# Altium project PROC114E3_SCH.PrjPcb (part 17 of 22)

## Sheet 34.SchDoc
size 513 x 386 mm
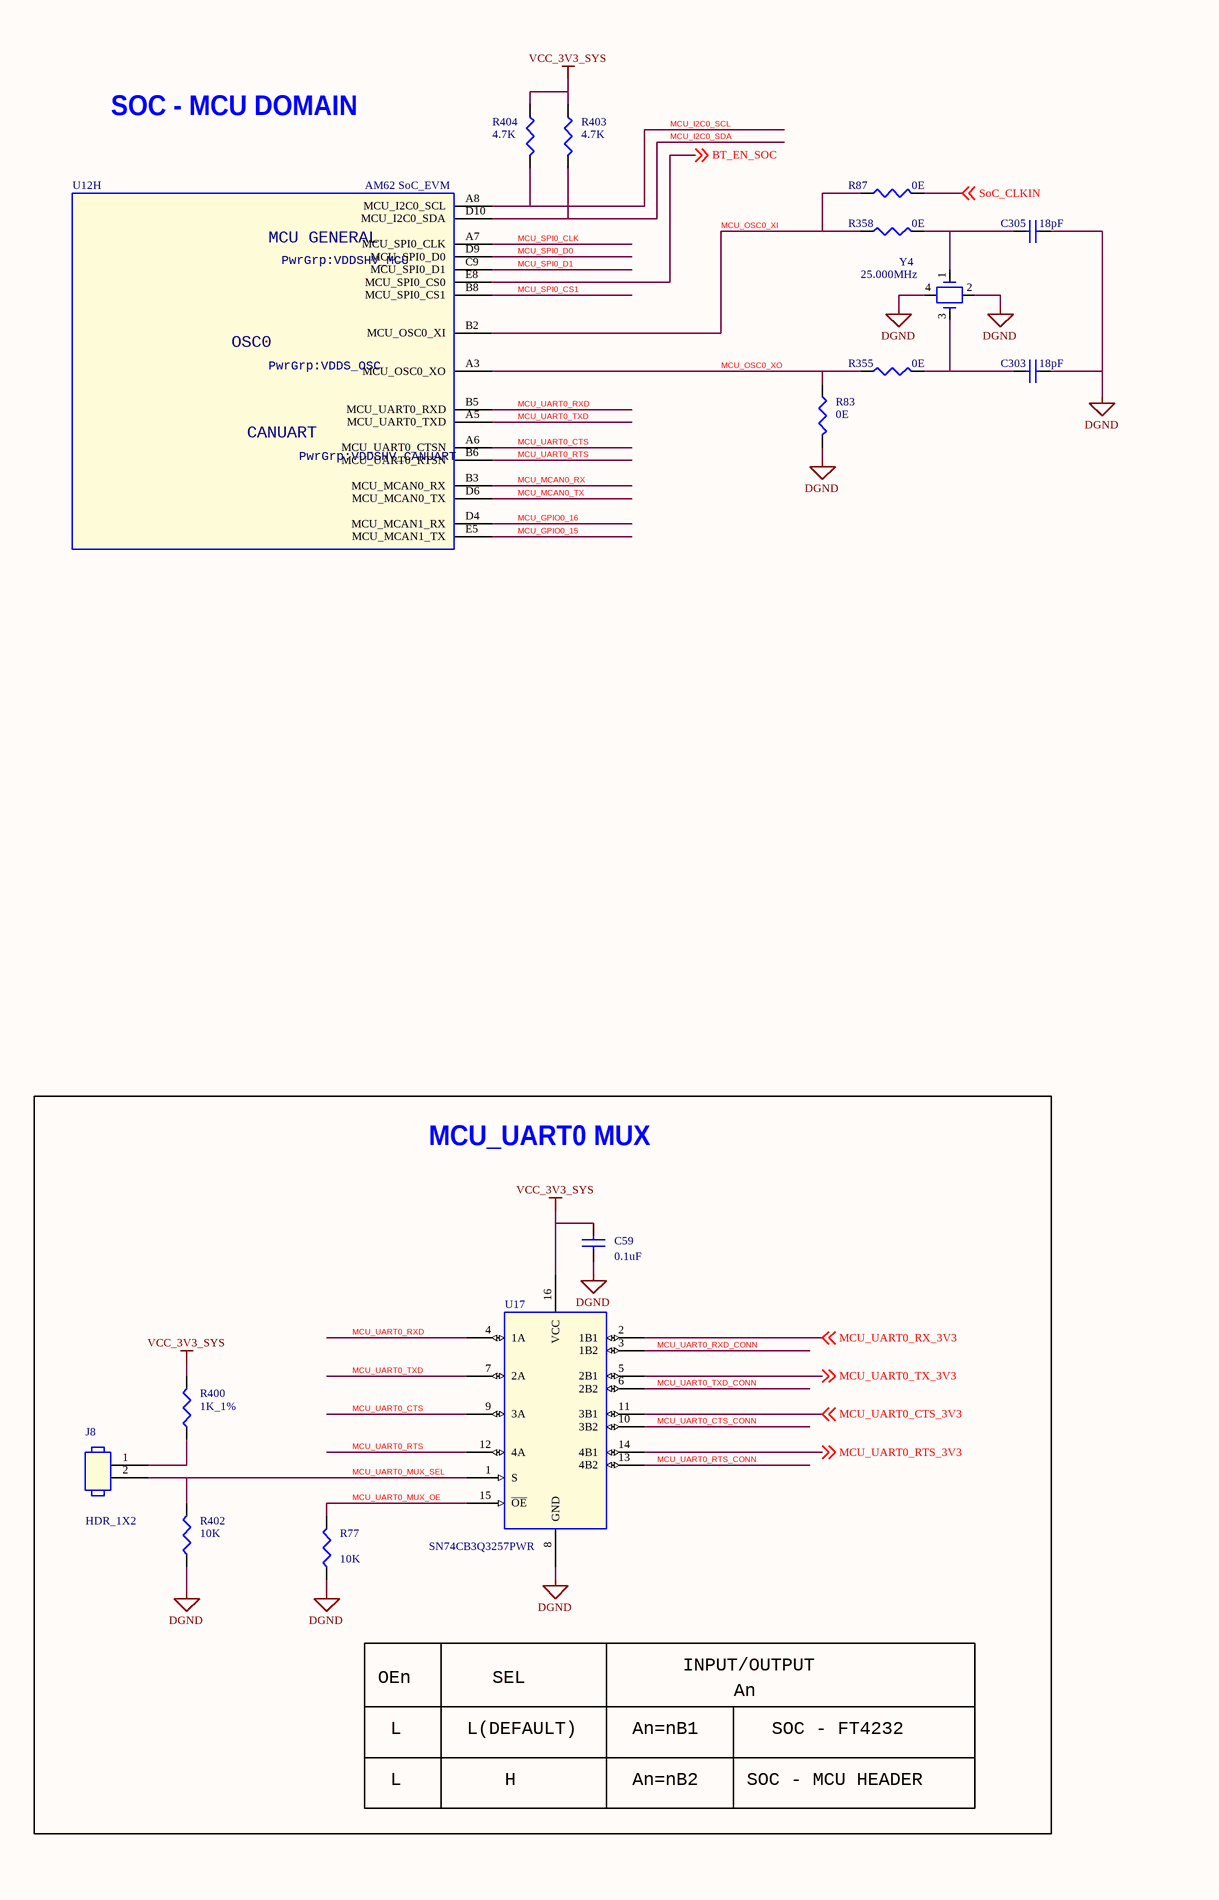
[diagram p60: 34.SchDoc, left]
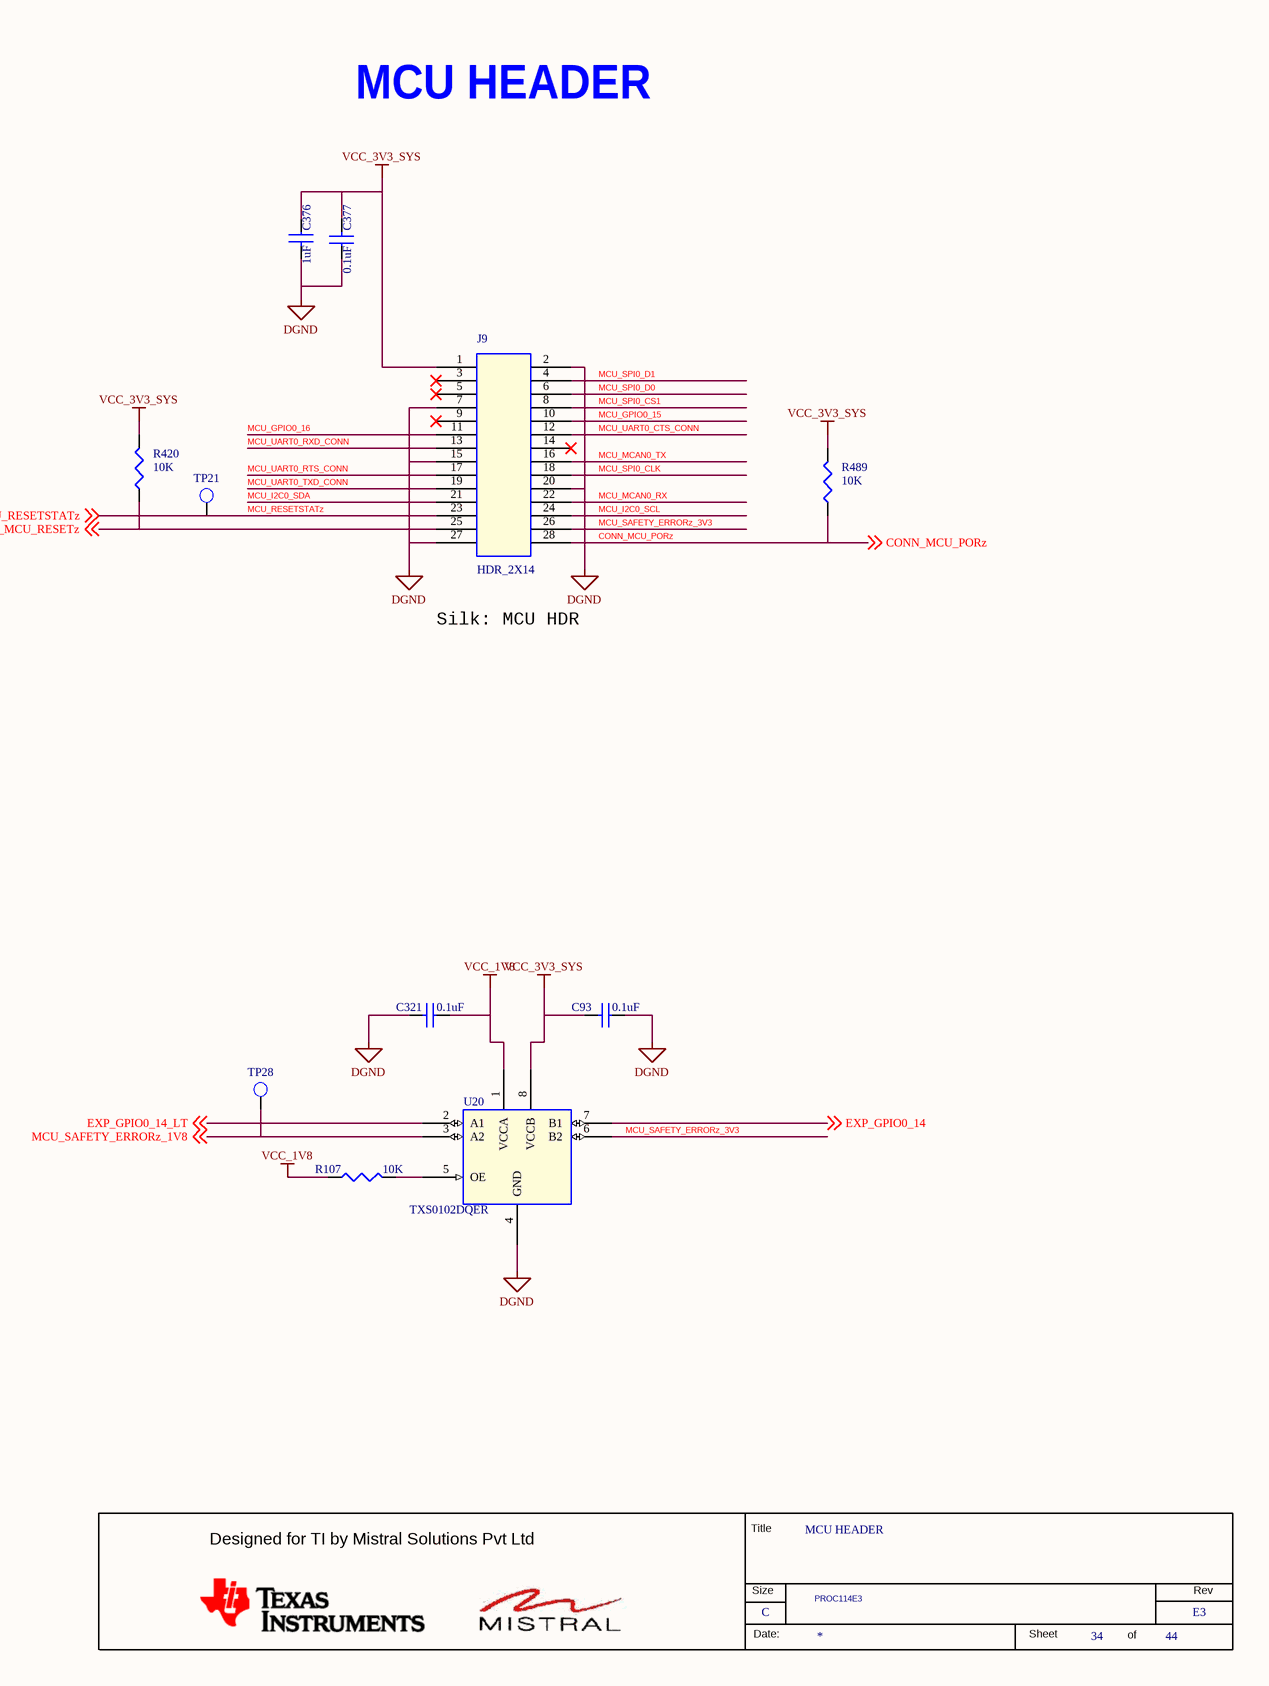
[diagram p61: 34.SchDoc, right]

### Parts
(Parts that share a designator on the sheet are numbered #1, #2 ... from top to bottom, then left to right.)
*#34  RevCode: E3  Title: MCU HEADER  Page Size: C  Page Number: 34  Page Count: 44  Variant Name: PROC114E3  (hidden comment: MISTRAL_TITLEBLK_CSIZE)  (graphical)
C59  0.1uF  [CAP0402_0-75]
C93  0.1uF  [CAP0201_0-5]
C303  18pF  [CAP0402_0-75]
C305  18pF  [CAP0402_0-75]
C321  0.1uF  [CAP0201_0-5]
C376  1uF  [CAP0201_0-5]
C377  0.1uF  [CAP0402_0-75]
J8  HDR_1X2  [HDR_1X2_90120-0122_S_T_5-6]
J9  HDR_2X14  [HDR_14X2_100_S_T]
R77  10K  [RES0201_0-5]
R83  0E  [RES0201_0-5]
R87  0E  [RES0201_0-5]
R107  10K  [RES0201_0-5]
R355  0E  [RES0402_0-5]
R358  0E  [RES0402_0-5]
R400  1K_1%  [RES0402_0-5]
R402  10K  [RES0201_0-5]
R403  4.7K  [RES0201_0-5]
R404  4.7K  [RES0201_0-5]
R420  10K  [RES0201_0-5]
R489  10K  [RES0201_0-5]
TP21  TP20_SMD  [TP20_SMD]  (value not drawn)
TP28  TP20_SMD  [TP20_SMD]  (value not drawn)
U12#2  AM62 SoC_EVM  [BGA425_19-68_510X510_0-7]  (part H of 18)
U17  SN74CB3Q3257PWR  [TSSOP16_25-59_205X180]
U20  TXS0102DQER  [X2SON8_TXS0102_40X60_0-4]
Y4  25.000MHz  [XTAL4_XRCGB-FM_80X60_SMD_0-7]

### Blocks framed on the sheet
MCU_UART0 MUX: C59 J8 R77 R400 R402 U17

### Nets
DGND: C59.1 C93.1 C303.1 C305.1 C321.2 C376.2 C377.1 J9.2 J9.7 J9.15 J9.20 J9.27 R77.2 R83.1 R402.1 U17.8(GND) U20.4(GND) Y4.2 Y4.4
VCC_1V8: C321.1 R107.1 U20.1(VCCA)
VCC_3V3_SYS: C59.2 C93.2 C376.1 C377.2 J9.1 R400.2 R403.1 R404.1 R420.2 R489.2 U17.16(VCC) U20.8(VCCB)
BT_EN_SOC: U12#2.E8(MCU_SPI0_CS0) ; off-sheet BT_EN_SOC
CONN_MCU_PORz: J9.28 R489.1 ; off-sheet CONN_MCU_PORz
CONN_MCU_RESETz: J9.25 R420.1 ; off-sheet CONN_MCU_RESETz
EXP_GPIO0_14: U20.7(B1) ; off-sheet EXP_GPIO0_14
EXP_GPIO0_14_LT: U20.2(A1) ; off-sheet EXP_GPIO0_14_LT
MCU_GPIO0_15: J9.10 U12#2.E5(MCU_MCAN1_TX)
MCU_GPIO0_16: J9.11 U12#2.D4(MCU_MCAN1_RX)
MCU_I2C0_SCL: J9.24 R404.2 U12#2.A8(MCU_I2C0_SCL)
MCU_I2C0_SDA: J9.21 R403.2 U12#2.D10(MCU_I2C0_SDA)
MCU_MCAN0_RX: J9.22 U12#2.B3(MCU_MCAN0_RX)
MCU_MCAN0_TX: J9.16 U12#2.D6(MCU_MCAN0_TX)
MCU_OSC0_XI: R87.2 R358.2 U12#2.B2(MCU_OSC0_XI)
MCU_OSC0_XO: R83.2 R355.2 U12#2.A3(MCU_OSC0_XO)
MCU_RESETSTATz: J9.23 TP21.1(TP) ; off-sheet MCU_RESETSTATz
MCU_SAFETY_ERRORz_1V8: TP28.1(TP) U20.3(A2) ; off-sheet MCU_SAFETY_ERRORz_1V8
MCU_SAFETY_ERRORz_3V3: J9.26 U20.6(B2)
MCU_SPI0_CLK: J9.18 U12#2.A7(MCU_SPI0_CLK)
MCU_SPI0_CS1: J9.8 U12#2.B8(MCU_SPI0_CS1)
MCU_SPI0_D0: J9.6 U12#2.D9(MCU_SPI0_D0)
MCU_SPI0_D1: J9.4 U12#2.C9(MCU_SPI0_D1)
MCU_UART0_CTS: U12#2.A6(MCU_UART0_CTSN) U17.9(3A)
MCU_UART0_CTS_3V3: U17.11(3B1) ; off-sheet MCU_UART0_CTS_3V3
MCU_UART0_CTS_CONN: J9.12 U17.10(3B2)
MCU_UART0_MUX_OE: R77.1 U17.15(~{OE})
MCU_UART0_MUX_SEL: J8.2 R402.2 U17.1(S)
MCU_UART0_RTS: U12#2.B6(MCU_UART0_RTSN) U17.12(4A)
MCU_UART0_RTS_3V3: U17.14(4B1) ; off-sheet MCU_UART0_RTS_3V3
MCU_UART0_RTS_CONN: J9.17 U17.13(4B2)
MCU_UART0_RX_3V3: U17.2(1B1) ; off-sheet MCU_UART0_RX_3V3
MCU_UART0_RXD: U12#2.B5(MCU_UART0_RXD) U17.4(1A)
MCU_UART0_RXD_CONN: J9.13 U17.3(1B2)
MCU_UART0_TX_3V3: U17.5(2B1) ; off-sheet MCU_UART0_TX_3V3
MCU_UART0_TXD: U12#2.A5(MCU_UART0_TXD) U17.7(2A)
MCU_UART0_TXD_CONN: J9.19 U17.6(2B2)
SoC_CLKIN: R87.1 ; off-sheet SoC_CLKIN
NetC303_2: C303.2 R355.1 Y4.3
NetC305_2: C305.2 R358.1 Y4.1
NetJ8_1: J8.1 R400.1
NetR107_2: R107.2 U20.5(OE)

Not connected (* = marked no-connect by the designer): J9 3* 5* 9* 14*

### Notes on the sheet
- SOC - MCU DOMAIN
- MCU HEADER
- Silk: MCU HDR
- OEn
- SEL
- INPUT/OUTPUT
- L
- L(DEFAULT)
- An=nB1
- An
- SOC - FT4232
- H
- An=nB2
- SOC - MCU HEADER
- (in symbol AM62-EVM_BGA425, part H) MCU GENERAL; PwrGrp:VDDSHV_MCU; OSC0; PwrGrp:VDDS_OSC; CANUART; PwrGrp:VDDSHV_CANUART
- (in symbol MISTRAL_TITLEBLK_CSIZE) Title; Designed for TI by Mistral Solutions Pvt Ltd; Size; Rev; Date:; Sheet; of

### Library data of the parts
*#34 = MISTRAL_TITLEBLK_CSIZE: Issue: 1.0; Page Create Date: March  8, 1995; Page Modify Date: *; Schematic Page Count: 44; Schematic Page Number: 34
C59 = CAP_Dup2: as C177 on sheet 31; PCB Footprint: CAP0402_0-75; Tolerance: 10%; Voltage: 50V; Package: 0402; Distributor_name: DIGIKEY; Distributor_part_number: 490-10700-1-ND; Height: 0.55MM; Weight: 3.1mg; Temperature: -55°C+125°C; Datasheet: Y:\MIS_DATABASE\DATASHEETS\CAPACITORS\GRM155R71H104KE14.PDF; Crtd /date: ALVY/211020; Chkd/date: MANIRAJA/261020; MECHANICAL 3D STEP FILE: CAP0402_0-75; Library Ref: CAP; Footprint Ref: CAP0402_0-75; Library Path: Y:\MIS_DATABASE\Library\ALTIUM_TOOL\SCHEMATICS_PARTS\MS_DISCRETE_Library.schlib; Footprint Path: Y:\MIS_DATABASE\Library\ALTIUM_TOOL\PCB_FOOTPRINTS\Altium_Footprint_Lib.PcbLib
C93 C321 = CAP_Dup2: as C452 on sheet 31; PCB Footprint: CAP0201_0-5; Tolerance: 10%; Voltage: 16V; Package: 0201; Distributor_name: DIGIKEY; Distributor_part_number: 490-14305-1-ND; Height: 0.33MM; Weight: 0.33mg; Temperature: -55°C+85°C; Datasheet: Y:\MIS_DATABASE\DATASHEETS\CAPACITORS\GRM033R61C104KE14.PDF; Crtd /date: MANIRAJA/230118; Chkd/date: MANIRAJA/230118; MECHANICAL 3D STEP FILE: CAP0201_0-5; Library Ref: CAP; Footprint Ref: CAP0201_0-5; Library Path: Y:\MIS_DATABASE\Library\ALTIUM_TOOL\SCHEMATICS_PARTS\MS_DISCRETE_Library.schlib; Footprint Path: Y:\MIS_DATABASE\Library\ALTIUM_TOOL\PCB_FOOTPRINTS\Altium_Footprint_Lib.PcbLib
C303 C305 = CAP_Dup2: CAP CERAMIC 18pF 50V 5% HI-Q C0G(NP0) 0402; Part_type: CAPACITORS\CERAMIC; Mfr_part_number: GJM1555C1H180JB01D; Mfr_name: MURATA; Mistral Part No: 120014100019-R; Custom_Duty: 15%; Customs_HS_Code: 85322990; Wattage: NA; Project: DC_MIST_RDC; Footprint Path: Y:\MIS_DATABASE\Library\ALTIUM_TOOL\PCB_FOOTPRINTS\Altium_Footprint_Lib.PcbLib; Library Path: Y:\MIS_DATABASE\Library\ALTIUM_TOOL\SCHEMATICS_PARTS\MS_DISCRETE_Library.schlib; MECHANICAL 3D STEP FILE: CAP0402_0-75; Chkd/date: VASANTHA/030315; Crtd /date: NAVEED/271014; Datasheet: Y:\MIS_DATABASE\DATASHEETS\CAPACITORS\MURATA-GXX-SER_NOV17.PDF; Temperature: -55°C+125°C; Weight: 6mg; Height: 0.55MM; Library Ref: CAP; Distributor_part_number: 490-3119-1-ND; Distributor_name: DIGIKEY; Package: 0402; Voltage: 50V; Tolerance: 5%; Footprint Ref: CAP0402_0-75; PCB Footprint: CAP0402_0-75
C376 = CAP_Dup2: CAP CERAMIC 1uF 16V 20% X5R 0201; Mistral Part No: 120018090038-R; Mfr_name: MURATA; Mfr_part_number: GRM033R61C105ME15D; Part_type: CAPACITORS\CERAMIC; Project: QCS610_NANOSOM; Customs_HS_Code: 85322990; Custom_Duty: 15%; Wattage: NA; Tolerance: 20%; Voltage: 16V; Package: 0201; Distributor_name: DIGIKEY; Distributor_part_number: 490-18654-1-ND; Height: 0.39MM; Weight: 0.33mg; Temperature: -55°C+85°C; Datasheet: Y:\MIS_DATABASE\DATASHEETS\CAPACITORS\GRM033R61C105ME15.PDF; Crtd /date: ALVY/260520; Chkd/date: MANIRAJA/300520; MECHANICAL 3D STEP FILE: CAP0201_0-5; Library Path: Y:\MIS_DATABASE\Library\ALTIUM_TOOL\SCHEMATICS_PARTS\MS_DISCRETE_Library.schlib; Footprint Path: Y:\MIS_DATABASE\Library\ALTIUM_TOOL\PCB_FOOTPRINTS\Altium_Footprint_Lib.PcbLib; Library Ref: CAP; Footprint Ref: CAP0201_0-5; PCB Footprint: CAP0201_0-5
C377 = CAP_Dup2: as C182 on sheet 31; Footprint Path: Y:\MIS_DATABASE\Library\ALTIUM_TOOL\PCB_FOOTPRINTS\Altium_Footprint_Lib.PcbLib; Library Path: Y:\MIS_DATABASE\Library\ALTIUM_TOOL\SCHEMATICS_PARTS\MS_DISCRETE_Library.schlib; Footprint Ref: CAP0402_0-75; Library Ref: CAP; MECHANICAL 3D STEP FILE: CAP0402_0-75; Chkd/date: MANIRAJA/261020; Crtd /date: ALVY/211020; Datasheet: Y:\MIS_DATABASE\DATASHEETS\CAPACITORS\GRM155R71H104KE14.PDF; Temperature: -55°C+125°C; Weight: 3.1mg; Height: 0.55MM; Distributor_part_number: 490-10700-1-ND; Distributor_name: DIGIKEY; Package: 0402; Voltage: 50V; Tolerance: 10%; PCB Footprint: CAP0402_0-75
J8 = HEADER_2X1: CON HDR 1X2 2.54MM PITCH ST TH; Part_type: CONNECTOR\HEADERS; Mfr_part_number: 90120-0122; Mfr_name: MOLEX; Mistral Part No: 150012100005-R; Custom_Duty: 24%; Customs_HS_Code: 85369090; Project: NPOL_FEP; Tolerance: NA; Chkd/date: NAVEED/210714; Crtd /date: USMAN/031012; Datasheet: Y:\MIS_DATABASE\DATASHEETS\CONNECTORS\90120-XX.PDF; Height: 5.60MM; Distributor_part_number: WM8072-ND; Distributor_name: DIGIKEY; Package: THRU-HOLE; Voltage: NA; Wattage: NA; Weight: 122mg; Temperature: -55°C+125°C; MECHANICAL 3D STEP FILE: HDR_1X2_90120-0122_S_T_5-6; Library Path: Y:\MIS_DATABASE\Library\ALTIUM_TOOL\SCHEMATICS_PARTS\MS_CONNECTOR_Library.schlib; Footprint Path: Y:\MIS_DATABASE\Library\ALTIUM_TOOL\PCB_FOOTPRINTS\Altium_Footprint_Lib.PcbLib; Library Ref: HEADER_2X1; Footprint Ref: HDR_1X2_90120-0122_S_T_5-6; PCB Footprint: HDR_1X2_90120-0122_S_T_5-6
J9 = HEADER_14x2: CON HDR 2X14 2.54MM PITCH ST TH; Part_type: CONNECTOR\HEADERS; Mfr_part_number: PREC014DAAN-RC; Mfr_name: SULLINS; Mistral Part No: 150014110005-R; Custom_Duty: 0.24; Customs_HS_Code: 85369090; Wattage: NA; Project: GALILEO_EVM; Chkd/date: NAVEED/280515; Crtd /date: VASANTHA/111114; Datasheet: Y:\MIS_DATABASE\DATASHEETS\CONNECTORS\PRXXXN-RC.PDF; Temperature: -40°C+105°C; Weight: NA; Height: 8.34MM; Library Ref: HEADER_14x2; Distributor_part_number: S2012EC-14-ND; Distributor_name: DIGIKEY; Package: THRU-HOLE; Voltage: NA; Tolerance: NA; PCB Footprint: HDR_14X2_100_S_T
R77 R107 R420 = RESISTOR_Dup6: as R537 on sheet 30; Footprint Path: Y:\MIS_DATABASE\Library\ALTIUM_TOOL\PCB_FOOTPRINTS\Altium_Footprint_Lib.PcbLib; Library Path: Y:\MIS_DATABASE\Library\ALTIUM_TOOL\SCHEMATICS_PARTS\MS_DISCRETE_Library.schlib; Footprint Ref: RES0201_0-5; Library Ref: RESISTOR; MECHANICAL 3D STEP FILE: RES0201_0-5; Chkd/date: MANIRAJA/050517; Crtd /date: MANIRAJA/050517; Datasheet: Y:\MIS_DATABASE\DATASHEETS\RESISTORS\RCXXXXL-SER_MAR18.PDF; Temperature: -55°C+125°C; Weight: 0.17mg; Height: 0.26MM; Distributor_part_number: 311-10KNCT-ND; Distributor_name: DIGIKEY; Package: 0201; Wattage: 1/20W; Tolerance: 5%; PCB Footprint: RES0201_0-5
R83 R87 = RESISTOR_Dup4: as R422 on sheet 32; PCB Footprint: RES0201_0-5; Footprint Path: Y:\MIS_DATABASE\Library\ALTIUM_TOOL\PCB_FOOTPRINTS\Altium_Footprint_Lib.PcbLib; Library Path: Y:\MIS_DATABASE\Library\ALTIUM_TOOL\SCHEMATICS_PARTS\MS_DISCRETE_Library.schlib; Footprint Ref: RES0201_0-5; Library Ref: RESISTOR; Tolerance: 5%; Wattage: 1/20W; Package: 0201; Distributor_name: DIGIKEY; Distributor_part_number: 311-0.0NCT-ND; Height: 0.26MM; Weight: 0.17mg; Temperature: -55°C+125°C; Datasheet: Y:\MIS_DATABASE\DATASHEETS\RESISTORS\RCXXXXL-SER_MAR18.PDF; Crtd /date: MUDDU/120710; Chkd/date: NAVEED/301214; MECHANICAL 3D STEP FILE: RES0201_0-5
R355 R358 = RESISTOR_Dup4: RES 0E 1/16W JUMPER 0402; Part_type: RESISTORS\FIXED; Mfr_part_number: CRCW04020000Z0ED; Mfr_name: VISHAY; Mistral Part No: 110010080019-R; Custom_Duty: 15%; Customs_HS_Code: 85332119; Voltage: NA; Project: PB_BUGBASE; PCB Footprint: RES0402_0-5; MECHANICAL 3D STEP FILE: RES0402_0-5; Chkd/date: VASANTHA/201216; Crtd /date: MUDDU/190810; Datasheet: Y:\MIS_DATABASE\DATASHEETS\RESISTORS\CRCW0603.PDF; Temperature: -55°C+155°C; Weight: 0.65mg; Height: 0.40MM; Distributor_part_number: 541-0.0JCT-ND; Distributor_name: DIGIKEY; Package: 0402; Wattage: 1/16W; Tolerance: NA; Library Ref: RESISTOR; Footprint Ref: RES0402_0-5; Library Path: Y:\MIS_DATABASE\Library\ALTIUM_TOOL\SCHEMATICS_PARTS\MS_DISCRETE_Library.schlib; Footprint Path: Y:\MIS_DATABASE\Library\ALTIUM_TOOL\PCB_FOOTPRINTS\Altium_Footprint_Lib.PcbLib
R400 = RESISTOR_Dup4: RES 1K 1/10W 1% 0402; Part_type: RESISTORS\FIXED; Mfr_part_number: ERJ-2RKF1001X; Mfr_name: PANASONIC-ECG; Mistral Part No: 110009030411-R; Custom_Duty: 15%; Customs_HS_Code: 85332119; Voltage: NA; Project: VOCERA; Chkd/date: VASANTHA/281216; Crtd /date: MAZHAR/150506; Datasheet: Y:\MIS_DATABASE\DATASHEETS\RESISTORS\PAN-ERJSER_NOV17.PDF; Temperature: -55°C+155°C; Weight: 0.8mg; Height: 0.40MM; Distributor_part_number: P1.00KLCT-ND; Distributor_name: DIGIKEY; Package: 0402; Wattage: 1/10W; Tolerance: 1%; Library Ref: RESISTOR; Footprint Ref: RES0402_0-5; MECHANICAL 3D STEP FILE: RES0402_0-5; Library Path: Y:\MIS_DATABASE\Library\ALTIUM_TOOL\SCHEMATICS_PARTS\MS_DISCRETE_Library.schlib; Footprint Path: Y:\MIS_DATABASE\Library\ALTIUM_TOOL\PCB_FOOTPRINTS\Altium_Footprint_Lib.PcbLib; PCB Footprint: RES0402_0-5
R402 R489 = RESISTOR_Dup6: as R541 on sheet 31; Footprint Ref: RES0201_0-5; Tolerance: 5%; Wattage: 1/20W; Package: 0201; Distributor_name: DIGIKEY; Distributor_part_number: 311-10KNCT-ND; Library Ref: RESISTOR; Height: 0.26MM; Weight: 0.17mg; Temperature: -55°C+125°C; Datasheet: Y:\MIS_DATABASE\DATASHEETS\RESISTORS\RCXXXXL-SER_MAR18.PDF; Crtd /date: MANIRAJA/050517; Chkd/date: MANIRAJA/050517; MECHANICAL 3D STEP FILE: RES0201_0-5; Library Path: Y:\MIS_DATABASE\Library\ALTIUM_TOOL\SCHEMATICS_PARTS\MS_DISCRETE_Library.schlib; Footprint Path: Y:\MIS_DATABASE\Library\ALTIUM_TOOL\PCB_FOOTPRINTS\Altium_Footprint_Lib.PcbLib; PCB Footprint: RES0201_0-5
R403 = RESISTOR_Dup6: as R561 on sheet 31; PCB Footprint: RES0201_0-5; Footprint Path: Y:\MIS_DATABASE\Library\ALTIUM_TOOL\PCB_FOOTPRINTS\Altium_Footprint_Lib.PcbLib; Library Path: Y:\MIS_DATABASE\Library\ALTIUM_TOOL\SCHEMATICS_PARTS\MS_DISCRETE_Library.schlib; MECHANICAL 3D STEP FILE: RES0201_0-5; Chkd/date: MANIRAJA/200921; Crtd /date: ALVY/200921; Datasheet: Y:\MIS_DATABASE\DATASHEETS\RESISTORS\RCXXXXL-SER_MAR18.PDF; Temperature: -55°C+125°C; Weight: 0.17mg; Height: 0.26MM; Library Ref: RESISTOR; Distributor_part_number: 311-4.7KNCT-ND; Distributor_name: DIGIKEY; Package: 0201; Wattage: 1/20W; Tolerance: 5%; Footprint Ref: RES0201_0-5
R404 = RESISTOR_Dup6: as R592 on sheet 30; PCB Footprint: RES0201_0-5; Footprint Ref: RES0201_0-5; Tolerance: 5%; Wattage: 1/20W; Package: 0201; Distributor_name: DIGIKEY; Distributor_part_number: 311-4.7KNCT-ND; Library Ref: RESISTOR; Height: 0.26MM; Weight: 0.17mg; Temperature: -55°C+125°C; Datasheet: Y:\MIS_DATABASE\DATASHEETS\RESISTORS\RCXXXXL-SER_MAR18.PDF; Crtd /date: ALVY/200921; Chkd/date: MANIRAJA/200921; MECHANICAL 3D STEP FILE: RES0201_0-5; Library Path: Y:\MIS_DATABASE\Library\ALTIUM_TOOL\SCHEMATICS_PARTS\MS_DISCRETE_Library.schlib; Footprint Path: Y:\MIS_DATABASE\Library\ALTIUM_TOOL\PCB_FOOTPRINTS\Altium_Footprint_Lib.PcbLib
TP21 = TESTPOINT: as TP60 on sheet 31; Customs_HS_Code: NA; RoHS: NA; Footprint Ref: TP20_SMD; Library Ref: TESTPOINT; Footprint Path: Y:\MIS_DATABASE\Library\ALTIUM_TOOL\PCB_FOOTPRINTS\Altium_Footprint_Lib.PcbLib; Library Path: Y:\MIS_DATABASE\Library\ALTIUM_TOOL\SCHEMATICS_PARTS\MS_DISCRETE_Library.schlib; MECHANICAL 3D STEP FILE: NA; Datasheet: NA; Temperature: NA; Weight: NA; Wattage: NA; Voltage: NA; Tolerance: NA; Chkd/date: SHREESHAIL/171006; Crtd /date: MAZHAR/171006; Height: NA; Distributor_part_number: NA; Distributor_name: NA; Package: SMD; Part_type: TESTPOINT; Mfr_part_number: TP20_SMD; Mistral Part No: NA; PCB Footprint: TP20_SMD
TP28 = TESTPOINT: as TP25 on sheet 32; PCB Footprint: TP20_SMD; Mfr_part_number: TP20_SMD; Part_type: TESTPOINT; Package: SMD; Distributor_name: NA; Distributor_part_number: NA; Height: NA; Crtd /date: MAZHAR/171006; Chkd/date: SHREESHAIL/171006; Tolerance: NA; Voltage: NA; Wattage: NA; Weight: NA; Temperature: NA; Datasheet: NA; MECHANICAL 3D STEP FILE: NA; Library Path: Y:\MIS_DATABASE\Library\ALTIUM_TOOL\SCHEMATICS_PARTS\MS_DISCRETE_Library.schlib; Footprint Path: Y:\MIS_DATABASE\Library\ALTIUM_TOOL\PCB_FOOTPRINTS\Altium_Footprint_Lib.PcbLib; Library Ref: TESTPOINT; Footprint Ref: TP20_SMD; RoHS: NA; Customs_HS_Code: NA; Custom_Duty: NA
U12#2 = AM62-EVM_BGA425: as U12#2 on sheet 32; PCB Footprint: BGA425_19-68_510X510_0-7; Mfr_part_number: AM62 SoC_EVM; Voltage: NA; Wattage: NA; Package: BGA425; Distributor_name: NA; Distributor_part_number: NA; Library Ref: AM62-EVM_BGA425; Footprint Ref: BGA425_19-68_510X510_0-7; Height: 0.65MM; Weight: NA; Temperature: NA; Datasheet: Y:\MIS_DATABASE\DATASHEETS\ICS\DIGITAL\MICROCONTROLLER\AM62-SoC_SVB.PDF; Crtd /date: MANIRAJA/110621; Chkd/date: ALVY/110621; RoHS: NA; MECHANICAL 3D STEP FILE: BGA425_19-68_510X510_0-7; Library Path: Y:\MIS_DATABASE\Library\ALTIUM_TOOL\SCHEMATICS_PARTS\MS_MICROPROCESSOR_Library.schlib; Footprint Path: Y:\MIS_DATABASE\Library\ALTIUM_TOOL\PCB_FOOTPRINTS\Altium_Footprint_Lib.PcbLib
U17 = SN74CB3Q3257PWR_TSSOP16: IC 4BIT 1-OF-2 FET MULTIPLEXER/DEMULTIPLEXER TSSOP16; Part_type: ICS\DIGITAL\COMBINATIONAL; Mfr_name: TEXAS INSTRUMENTS; Mistral Part No: 141009030117-R; Custom_Duty: 15%; Customs_HS_Code: 85423100; Project: OMAP_EVM; RoHS: Sb/ Br FREE; Chkd/date: SUHAS/251010; Crtd /date: USMAN/060109; Datasheet: Y:\MIS_DATABASE\DATASHEETS\ICS\DIGITAL\COMBINATIONAL\SN74CB3Q3257.PDF; Temperature: -40°C+85°C; Height: 1.20MM; Library Ref: SN74CB3Q3257PWR_TSSOP16; Distributor_part_number: 296-19138-1-ND; Distributor_name: DIGIKEY; Package: TSSOP16; Mfr_part_number: SN74CB3Q3257PWR; PCB Footprint: TSSOP16_25-59_205X180
U20 = TXS0102DQX_SON8: IC 2-BIT BI-DIR VOLTAGE-LEVEL TRANSLATOR FOR OPEN-DRAIN AND PUSH-PULL X2SON8; Part_type: ICS\INTERFACE\LEVEL TRANSLATOR; Mfr_name: TEXAS INSTRUMENTS; Mistral Part No: 141012050010-R; Custom_Duty: 15%; Customs_HS_Code: 85423100; Wattage: NA; Project: GEN_3-8_DB; PCB Footprint: X2SON8_TXS0102_40X60_0-4; Footprint Path: Y:\MIS_DATABASE\Library\ALTIUM_TOOL\PCB_FOOTPRINTS\Altium_Footprint_Lib.PcbLib; Library Path: Y:\MIS_DATABASE\Library\ALTIUM_TOOL\SCHEMATICS_PARTS\MS_MISCINTERFACE_Library.schlib; MECHANICAL 3D STEP FILE: X2SON8_TXS0102_40X60_0-4; Chkd/date: MANIRAJA/010719; Crtd /date: CHAITHANYA230512; Datasheet: Y:\MIS_DATABASE\DATASHEETS\ICS\INTERFACE\TXS0102-SER.PDF; Temperature: -40°C+85°C; Weight: 1.2mg; Height: 0.40MM; Library Ref: TXS0102DQX_SON8; Distributor_part_number: 296-28368-1-ND; Distributor_name: DIGIKEY; Package: X2SON8; Voltage: NA; Tolerance: NA; Mfr_part_number: TXS0102DQER; Footprint Ref: X2SON8_TXS0102_40X60_0-4
Y4 = CRY4_13: CRY 25.000MHz 6pF SMD; Mistral Part No: 130020100043-R; Mfr_name: MURATA; Mfr_part_number: XRCGB25M000F3M00R0; Part_type: CRYSTAL; Project: AM64X_SKEVM; Tolerance: NA; Customs_HS_Code: 85439000; Custom_Duty: 24%; PCB Footprint: XTAL4_XRCGB-FM_80X60_SMD_0-7; Footprint Ref: XTAL4_XRCGB-FM_80X60_SMD_0-7; Voltage: NA; Wattage: NA; Package: SMD; Distributor_name: DIGIKEY; Distributor_part_number: 490-5578-1-ND; Library Ref: CRY4_13; Height: 0.70MM; Weight: 23mg; Temperature: -30°C+85°C; Datasheet: Y:\MIS_DATABASE\DATASHEETS\MISC\CRY_OSC\XRCGB.PDF; Crtd /date: ALVY/151020; Chkd/date: MANIRAJA/151020; MECHANICAL 3D STEP FILE: XTAL4_XRCGB-FM_80X60_SMD_0-7; Library Path: Y:\MIS_DATABASE\Library\ALTIUM_TOOL\SCHEMATICS_PARTS\MS_DISCRETE_Library.schlib; Footprint Path: Y:\MIS_DATABASE\Library\ALTIUM_TOOL\PCB_FOOTPRINTS\Altium_Footprint_Lib.PcbLib

## Sheet 35.SchDoc
size 513 x 386 mm
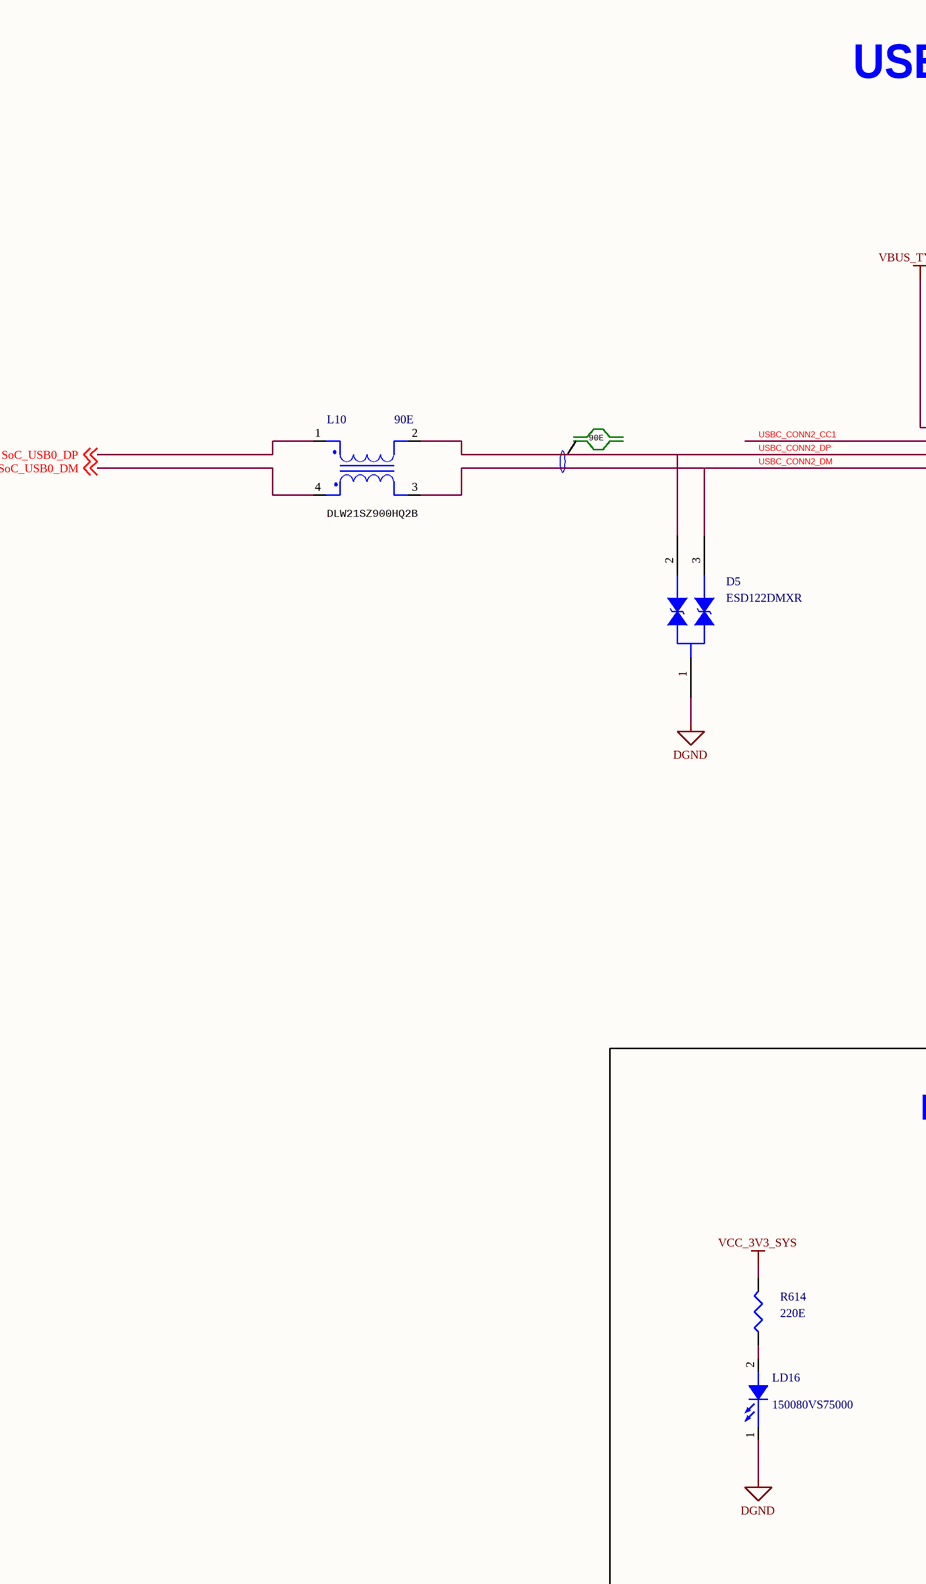
[diagram p62: 35.SchDoc, left]
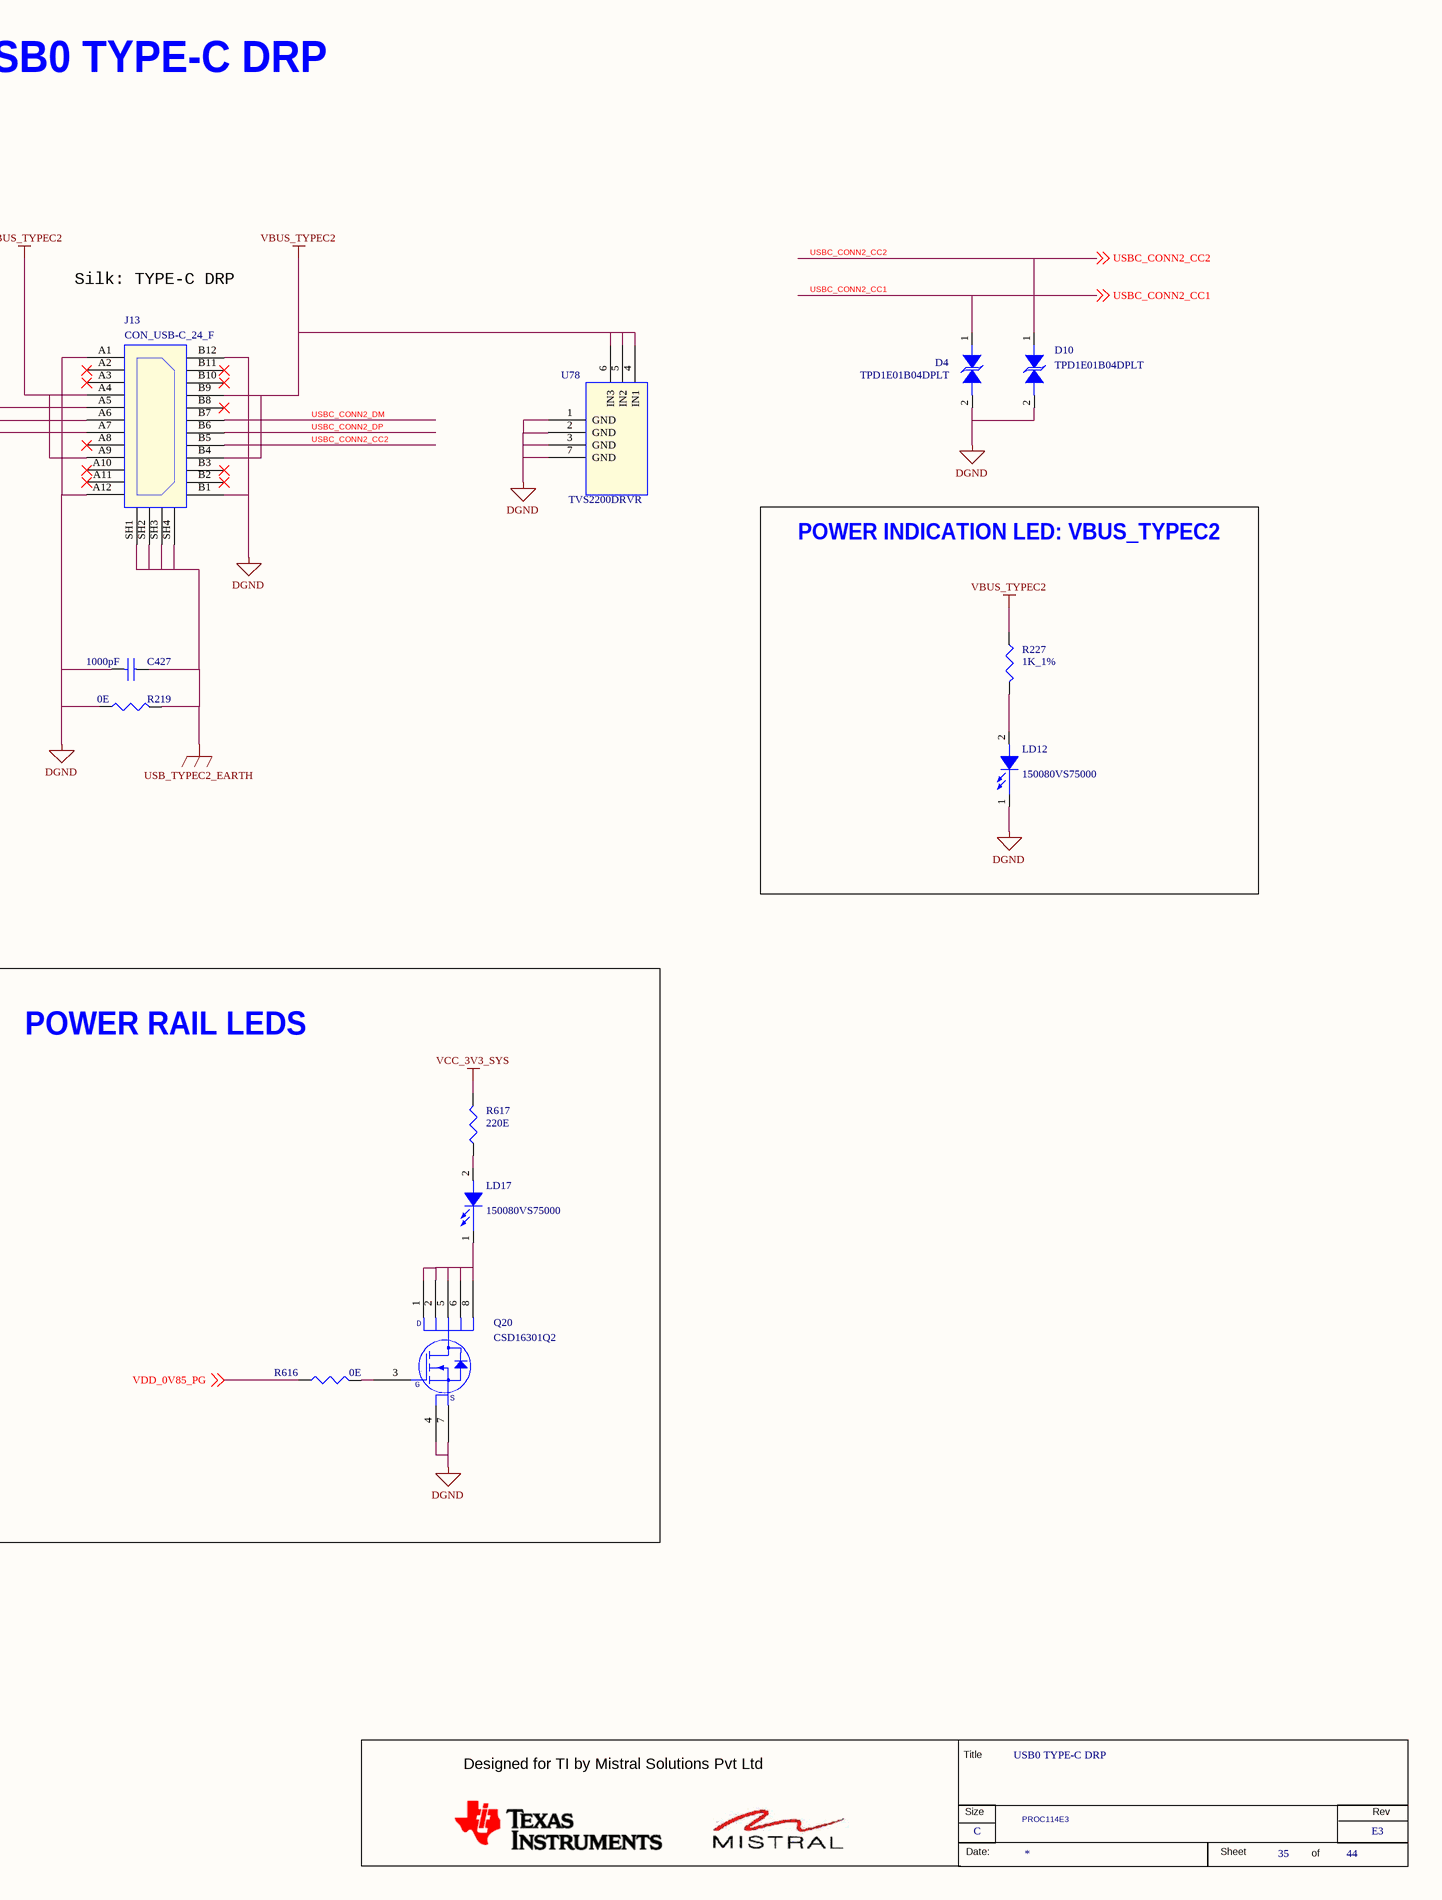
[diagram p63: 35.SchDoc, right]

### Parts
(Parts that share a designator on the sheet are numbered #1, #2 ... from top to bottom, then left to right.)
*#35  RevCode: E3  Title: USB0 TYPE-C DRP  Page Size: C  Page Number: 35  Page Count: 44  Variant Name: PROC114E3  (hidden comment: MISTRAL_TITLEBLK_CSIZE)  (graphical)
C427  1000pF  [CAP1206_1-75]
D4  TPD1E01B04DPLT  [DIO_DFN0201_0-4]
D5  ESD122DMXR  [X2SON3_ESD122DMX_30X40_0-4]
D10  TPD1E01B04DPLT  [DIO_DFN0201_0-4]
J13  CON_USB-C_24_F  [CON_USBC24_2012670_S_R_S_3-9]
L10  90E  [IND4_DLW21H_90X60_SMD_1-4]
LD12  150080VS75000  [LED_150080VS75000_80X50_SMD_0-8]
LD16  150080VS75000  [LED_150080VS75000_80X50_SMD_0-8]
LD17  150080VS75000  [LED_150080VS75000_80X50_SMD_0-8]
Q20  CSD16301Q2  [WSON6_CSD13202Q2_80X80_0-8]
R219  0E  [RES0603_0-75]
R227  1K_1%  [RES0402_0-5]
R614  220E  [RES0402_0-5]
R616  0E  [RES0402_0-5]
R617  220E  [RES0402_0-5]
U78  TVS2200DRVR  [SON6_25-59_85X85_0-8]

### Blocks framed on the sheet
POWER INDICATION LED: VBUS_TYPEC2: LD12 R227
POWER RAIL LEDS: LD16 LD17 Q20 R614 R616 R617

### Nets
DGND: C427.2 D4.2(ANODE) D5.1(GND) D10.2(ANODE) J13.A1(GND) J13.A12(GND) J13.B1(GND) J13.B12(GND) LD12.1(CATHODE) LD16.1(CATHODE) Q20.4(S1) Q20.7(S2) R219.2 U78.1(GND) U78.2(GND) U78.3(GND) U78.7(GND)
USB_TYPEC2_EARTH: C427.1 J13.SH1 J13.SH2 J13.SH3 J13.SH4 R219.1
VBUS_TYPEC2: J13.A4(VBUS1) J13.A9(VBUS2) J13.B4(VBUS3) J13.B9(VBUS4) R227.1 U78.4(IN1) U78.5(IN2) U78.6(IN3)
VCC_3V3_SYS: R614.2 R617.2
SoC_USB0_DM: L10.4(OUT2) ; off-sheet SoC_USB0_DM
SoC_USB0_DP: L10.1(IN1) ; off-sheet SoC_USB0_DP
USBC_CONN2_CC1: D4.1(CATHODE) J13.A5(CC1) ; off-sheet USBC_CONN2_CC1
USBC_CONN2_CC2: D10.1(CATHODE) J13.B5(CC2) ; off-sheet USBC_CONN2_CC2
USBC_CONN2_DM: D5.3(IO2) J13.A7(D-_1) J13.B7(D-_2) L10.3(OUT1)
USBC_CONN2_DP: D5.2(IO1) J13.A6(D+_1) J13.B6(D+_2) L10.2(IN2)
VDD_0V85_PG: R616.1 ; off-sheet VDD_0V85_PG
NetLD12_2: LD12.2(ANODE) R227.2
NetLD16_2: LD16.2(ANODE) R614.1
NetLD17_1: LD17.1(CATHODE) Q20.1(D1) Q20.2(D2) Q20.5(D3) Q20.6(D4) Q20.8(D5)
NetLD17_2: LD17.2(ANODE) R617.1
NetQ20_3: Q20.3(G) R616.2

Not connected (* = marked no-connect by the designer): J13 A2(TX1+)* A3(TX1-)* A8(SBU1)* A10(RX2-)* A11(RX2+)* B2(TX2+)* B3(TX2-)* B8(SBU2)* B10(RX1-)* B11(RX1+)*

### Notes on the sheet
- USB0 TYPE-C DRP
- Silk: TYPE-C DRP
- 90E
- (near L10) DLW21SZ900HQ2B
- (in symbol MISTRAL_TITLEBLK_CSIZE) Title; Designed for TI by Mistral Solutions Pvt Ltd; Size; Rev; Date:; Sheet; of
- (in symbol MOSFET_CSD17313Q2) D; S

### Library data of the parts
*#35 = MISTRAL_TITLEBLK_CSIZE: Issue: 1.0; Page Create Date: March  8, 1995; Page Modify Date: *
C427 = CAP_Dup2: CAP CERAMIC 1000pF 2KV 10% X7R 1206; Mistral Part No: 120015080006-R; Mfr_name: AVX CORPORATION; Mfr_part_number: 1206GC102KAT1A; Part_type: CAPACITORS\CERAMIC; Project: ADR1B; Customs_HS_Code: 85322990; Custom_Duty: 15%; Wattage: NA; Tolerance: 10%; Voltage: 2KV; Package: 1206; Distributor_name: DIGIKEY; Distributor_part_number: 478-2956-1-ND; Height: 1.52MM; Weight: 16.2mg; Temperature: -55°C+125°C; Datasheet: Y:\MIS_DATABASE\DATASHEETS\CAPACITORS\AVX_HV-MLC.PDF; Crtd /date: MAZHAR/281106; Chkd/date: SHREESHAIL/291106; Library Ref: CAP; Footprint Ref: CAP1206_1-75; Library Path: Y:\MIS_DATABASE\Library\ALTIUM_TOOL\SCHEMATICS_PARTS\MS_DISCRETE_Library.schlib; Footprint Path: Y:\MIS_DATABASE\Library\ALTIUM_TOOL\PCB_FOOTPRINTS\Altium_Footprint_Lib.PcbLib; MECHANICAL 3D STEP FILE: CAP1206_1-75; PCB Footprint: CAP1206_1-75
D4 = DIODE_TVS_DUAL: DIODE 1CH ESD PROTECTION FOR USB TYPE-C AND THUNDERBOLT3 X2SON2; Mistral Part No: 130020090037-R; Mfr_name: TEXAS INSTRUMENTS; Part_type: DIODE\TVS; Project: AM64X_SKEVM; Tolerance: NA; Customs_HS_Code: 85412900; Custom_Duty: 15%; Footprint Ref: DIO_DFN0201_0-4; Mfr_part_number: TPD1E01B04DPLT; Voltage: NA; Wattage: NA; Package: X2SON2; Distributor_name: DIGIKEY; Distributor_part_number: 296-44484-1-ND; Library Ref: DIODE_TVS_DUAL; Height: 0.32MM; Weight: 0.2mg; Temperature: -40°C+125°C; Datasheet: Y:\MIS_DATABASE\DATASHEETS\DISCRETES\DIODES\TPD1E01B04.PDF; Crtd /date: ALVY/230920; Chkd/date: MANIRAJA/230920; MECHANICAL 3D STEP FILE: DIO_DFN0201_0-4; Library Path: Y:\MIS_DATABASE\Library\ALTIUM_TOOL\SCHEMATICS_PARTS\MS_DISCRETE_Library.schlib; Footprint Path: Y:\MIS_DATABASE\Library\ALTIUM_TOOL\PCB_FOOTPRINTS\Altium_Footprint_Lib.PcbLib; PCB Footprint: DIO_DFN0201_0-4
D5 = DIODE_ESD122DMXR: DIODE 2-CH ESD PROTECTION FOR USB TYPE-C AND HDMI 2.0 X2SON-3; Part_type: DIODE\TVS; Mfr_name: TEXAS INSTRUMENTS; Mistral Part No: 130017080015-R; Custom_Duty: 15%; Customs_HS_Code: 85412900; Wattage: NA; Project: TI_SVB_CONTROLLER CARD; MECHANICAL 3D STEP FILE: X2SON3_ESD122DMX_30X40_0-4; Chkd/date: MANIRAJA/140817; Crtd /date: MANIRAJA/140817; Datasheet: Y:\MIS_DATABASE\DATASHEETS\DISCRETES\DIODES\ESD122XX.PDF; Temperature: -40°C+125°C; Weight: NA; Height: 0.40MM; Library Ref: DIODE_ESD122DMXR; Distributor_part_number: ESD122DMXR-ND; Distributor_name: DIGIKEY; Package: X2SON-3; Voltage: NA; Tolerance: NA; Mfr_part_number: ESD122DMXR; PCB Footprint: X2SON3_ESD122DMX_30X40_0-4
D10 = DIODE_TVS_DUAL: DIODE 1CH ESD PROTECTION FOR USB TYPE-C AND THUNDERBOLT3 X2SON2; Part_type: DIODE\TVS; Mfr_name: TEXAS INSTRUMENTS; Mistral Part No: 130020090037-R; Custom_Duty: 15%; Customs_HS_Code: 85412900; Wattage: NA; Project: AM64X_SKEVM; Footprint Path: Y:\MIS_DATABASE\Library\ALTIUM_TOOL\PCB_FOOTPRINTS\Altium_Footprint_Lib.PcbLib; Library Path: Y:\MIS_DATABASE\Library\ALTIUM_TOOL\SCHEMATICS_PARTS\MS_DISCRETE_Library.schlib; MECHANICAL 3D STEP FILE: DIO_DFN0201_0-4; Chkd/date: MANIRAJA/230920; Crtd /date: ALVY/230920; Datasheet: Y:\MIS_DATABASE\DATASHEETS\DISCRETES\DIODES\TPD1E01B04.PDF; Temperature: -40°C+125°C; Weight: 0.2mg; Height: 0.32MM; Library Ref: DIODE_TVS_DUAL; Distributor_part_number: 296-44484-1-ND; Distributor_name: DIGIKEY; Package: X2SON2; Voltage: NA; Tolerance: NA; Mfr_part_number: TPD1E01B04DPLT; Footprint Ref: DIO_DFN0201_0-4; PCB Footprint: DIO_DFN0201_0-4
J13 = CON_USB-C_24_1240183621: CON USB-C TYPE 24POS FEMALE RT SMD; Part_type: CONNECTOR\USB; Mfr_part_number: 2012670005; Mfr_name: MOLEX; Mistral Part No: 150018060002-R; Custom_Duty: 24%; Customs_HS_Code: 85369090; Wattage: NA; Project: TI_J7SVB_USB_ADD-ON-CARD; Footprint Path: Y:\MIS_DATABASE\Library\ALTIUM_TOOL\PCB_FOOTPRINTS\Altium_Footprint_Lib.PcbLib; Library Path: Y:\MIS_DATABASE\Library\ALTIUM_TOOL\SCHEMATICS_PARTS\MS_CONNECTOR_Library.schlib; MECHANICAL 3D STEP FILE: CON_USBC24_2012670_S_R_S_3-9; Chkd/date: MANIRAJA/050618; Crtd /date: ALVY/040618; Datasheet: Y:\MIS_DATABASE\DATASHEETS\CONNECTORS\2012670X.PDF; Temperature: -40°C+105°C; Weight: 0.686g; Height: 3.86MM; Library Ref: CON_USB-C_24_1240183621; Distributor_part_number: WM17992CT-ND; Distributor_name: DIGIKEY; Package: SMD; Voltage: NA; Tolerance: NA; Footprint Ref: CON_USBC24_2012670_S_R_S_3-9; PCB Footprint: CON_USBC24_2012670_S_R_S_3-9
L10 = INDUCTOR_DLW31S: IND COMMON MODE CHOKE 90E 280mA SMD; Mfr_part_number: DLW21SZ900HQ2B; Mfr_name: MURATA; Mistral Part No: 130019060035-R; Custom_Duty: 24%; Customs_HS_Code: 85437099; Wattage: NA; Project: TI_J7ES_CP; Footprint Path: Y:\MIS_DATABASE\Library\ALTIUM_TOOL\PCB_FOOTPRINTS\Altium_Footprint_Lib.PcbLib; Library Path: Y:\MIS_DATABASE\Library\ALTIUM_TOOL\SCHEMATICS_PARTS\MS_DISCRETE_Library.schlib; MECHANICAL 3D STEP FILE: IND4_DLW21H_90X60_SMD_1-4; Chkd/date: MANIRAJA/270619; Crtd /date: MANIRAJA/270619; Datasheet: Y:\MIS_DATABASE\DATASHEETS\DISCRETES\INDUCTORS\DLW21SZ900HQ2B.PDF; Temperature: -40°C+105°C; Weight: 11mg; Height: 1.40MM; Footprint Ref: IND4_DLW21H_90X60_SMD_1-4; Library Ref: INDUCTOR_DLW31S; Distributor_part_number: NA; Distributor_name: NA; Package: SMD; Voltage: NA; Tolerance: NA; Part_type: INDUCTOR; PCB Footprint: IND4_DLW21H_90X60_SMD_1-4
LD12 LD17 = DIODE_LED: as LD13 on sheet 31; Footprint Ref: LED_150080VS75000_80X50_SMD_0-8; Mfr_part_number: 150080VS75000; Voltage: NA; Wattage: NA; Package: SMD; Distributor_name: DIGIKEY; Distributor_part_number: 732-4986-1-ND; Library Ref: DIODE_LED; Height: 0.80MM; Weight: 10mg; Temperature: -40°C+85°C; Datasheet: Y:\MIS_DATABASE\DATASHEETS\DISCRETES\LEDS\150080VS75000.PDF; Crtd /date: ALVY/180820; Chkd/date: MANIRAJA/180820; MECHANICAL 3D STEP FILE: LED_150080VS75000_80X50_SMD_0-8; Library Path: Y:\MIS_DATABASE\Library\ALTIUM_TOOL\SCHEMATICS_PARTS\MS_OPTO_Library.schlib; Footprint Path: Y:\MIS_DATABASE\Library\ALTIUM_TOOL\PCB_FOOTPRINTS\Altium_Footprint_Lib.PcbLib; PCB Footprint: LED_150080VS75000_80X50_SMD_0-8
LD16 = DIODE_LED: DIODE LED BRIGHT GREEN SMD; Part_type: OPTO\LED; Mfr_name: WURTH ELECTRONICS; Mistral Part No: 130020080012-R; Custom_Duty: 24%; Customs_HS_Code: 85439000; Wattage: NA; Project: AM64x_EVM_BRD; PCB Footprint: LED_150080VS75000_80X50_SMD_0-8; Footprint Path: Y:\MIS_DATABASE\Library\ALTIUM_TOOL\PCB_FOOTPRINTS\Altium_Footprint_Lib.PcbLib; Library Path: Y:\MIS_DATABASE\Library\ALTIUM_TOOL\SCHEMATICS_PARTS\MS_OPTO_Library.schlib; MECHANICAL 3D STEP FILE: LED_150080VS75000_80X50_SMD_0-8; Chkd/date: MANIRAJA/180820; Crtd /date: ALVY/180820; Datasheet: Y:\MIS_DATABASE\DATASHEETS\DISCRETES\LEDS\150080VS75000.PDF; Temperature: -40°C+85°C; Weight: 10mg; Height: 0.80MM; Library Ref: DIODE_LED; Distributor_part_number: 732-4986-1-ND; Distributor_name: DIGIKEY; Package: SMD; Voltage: NA; Tolerance: NA; Mfr_part_number: 150080VS75000; Footprint Ref: LED_150080VS75000_80X50_SMD_0-8
Q20 = MOSFET_CSD17313Q2: IC MOSFET N-CHANNEL NEXFET 25V WSON6; Part_type: ICS\POWER\MOSFET; Mfr_name: TEXAS INSTRUMENTS; Mistral Part No: 142020120008-R; Custom_Duty: 15%; Customs_HS_Code: 85423100; Wattage: NA; Project: TI_AM243x LP EVM; PCB Footprint: WSON6_CSD13202Q2_80X80_0-8; Footprint Path: Y:\MIS_DATABASE\Library\ALTIUM_TOOL\PCB_FOOTPRINTS\Altium_Footprint_Lib.PcbLib; Library Path: Y:\MIS_DATABASE\Library\ALTIUM_TOOL\SCHEMATICS_PARTS\MS_MOSFET_Library.schlib; MECHANICAL 3D STEP FILE: WSON6_CSD13202Q2_80X80_0-8; Chkd/date: ALVY/071220; Crtd /date: MANIRAJA/071220; Datasheet: Y:\MIS_DATABASE\DATASHEETS\ICS\POWER\CSD16301Q2.PDF; Temperature: -55°C+150°C; Weight: 8.7mg; Height: 0.80MM; Library Ref: MOSFET_CSD17313Q2; Distributor_part_number: 296-25260-1-ND; Distributor_name: DIGIKEY; Package: WSON6; Voltage: NA; Tolerance: NA; Mfr_part_number: CSD16301Q2; Footprint Ref: WSON6_CSD13202Q2_80X80_0-8
R219 = RESISTOR_Dup6: RES 0E 1/10W 5% 0603; Manufacturer: YAGEO AMERICA; Part_type: RESISTORS\FIXED; Mfr_part_number: RC0603JR-070RL; Mfr_name: PANASONIC-ECG; Mistral Part No: 110011020013-R; Custom_Duty: 15%; Customs_HS_Code: 85332119; Voltage: NA; Project: KENNEL; MECHANICAL 3D STEP FILE: RES0603_0-75; Chkd/date: MANIRAJA/051217; Crtd /date: BAVISH/180211; Datasheet: Y:\MIS_DATABASE\DATASHEETS\RESISTORS\RCXXXXL-SER_MAR18.PDF; Temperature: -55°C+155°C; Weight: 2mg; Height: 0.55MM; Distributor_part_number: 311-0.0GRCT-ND; Distributor_name: DIGIKEY; Package: 0603; Wattage: 1/10W; Tolerance: 5%; Library Ref: RESISTOR; Footprint Ref: RES0603_0-75; Library Path: Y:\MIS_DATABASE\Library\ALTIUM_TOOL\SCHEMATICS_PARTS\MS_DISCRETE_Library.schlib; Footprint Path: Y:\MIS_DATABASE\Library\ALTIUM_TOOL\PCB_FOOTPRINTS\Altium_Footprint_Lib.PcbLib; PCB Footprint: RES0603_0-75
R227 = RESISTOR_Dup6: RES 1K 1/10W 1% 0402; Mistral Part No: 110009030411-R; Mfr_name: PANASONIC-ECG; Mfr_part_number: ERJ-2RKF1001X; Part_type: RESISTORS\FIXED; Project: VOCERA; Voltage: NA; Customs_HS_Code: 85332119; Custom_Duty: 15%; Footprint Ref: RES0402_0-5; Tolerance: 1%; Wattage: 1/10W; Package: 0402; Distributor_name: DIGIKEY; Distributor_part_number: P1.00KLCT-ND; Library Ref: RESISTOR; Height: 0.40MM; Weight: 0.8mg; Temperature: -55°C+155°C; Datasheet: Y:\MIS_DATABASE\DATASHEETS\RESISTORS\PAN-ERJSER_NOV17.PDF; Crtd /date: MAZHAR/150506; Chkd/date: VASANTHA/281216; MECHANICAL 3D STEP FILE: RES0402_0-5; Library Path: Y:\MIS_DATABASE\Library\ALTIUM_TOOL\SCHEMATICS_PARTS\MS_DISCRETE_Library.schlib; Footprint Path: Y:\MIS_DATABASE\Library\ALTIUM_TOOL\PCB_FOOTPRINTS\Altium_Footprint_Lib.PcbLib; PCB Footprint: RES0402_0-5
R614 = RESISTOR_Dup6: RES 220E 1/10W 5% 0402; Mistral Part No: 110009030506-R; Mfr_name: PANASONIC-ECG; Mfr_part_number: ERJ-2GEJ221X; Part_type: RESISTORS\FIXED; Project: RED EYE; Customs_HS_Code: 85332119; Custom_Duty: 15%; Voltage: NA; PCB Footprint: RES0402_0-5; Footprint Ref: RES0402_0-5; Tolerance: 5%; Wattage: 1/10W; Package: 0402; Distributor_name: DIGIKEY; Distributor_part_number: P220JCT-ND; Height: 0.40MM; Datasheet: Y:\MIS_DATABASE\DATASHEETS\RESISTORS\PAN-ERJSER_NOV17.PDF; Crtd /date: GEETHA/260406; Chkd/date: VASANTHA/291216; Library Ref: RESISTOR; Weight: 0.8mg; Temperature: -55°C+155°C; MECHANICAL 3D STEP FILE: RES0402_0-5; Library Path: Y:\MIS_DATABASE\Library\ALTIUM_TOOL\SCHEMATICS_PARTS\MS_DISCRETE_Library.schlib; Footprint Path: Y:\MIS_DATABASE\Library\ALTIUM_TOOL\PCB_FOOTPRINTS\Altium_Footprint_Lib.PcbLib
R616 = RESISTOR_Dup6: RES 0E 1/16W JUMPER 0402; Mistral Part No: 110010080019-R; Mfr_name: VISHAY; Mfr_part_number: CRCW04020000Z0ED; Part_type: RESISTORS\FIXED; Project: PB_BUGBASE; Tolerance: NA; Customs_HS_Code: 85332119; Custom_Duty: 15%; PCB Footprint: RES0402_0-5; Footprint Ref: RES0402_0-5; Voltage: NA; Wattage: 1/16W; Package: 0402; Distributor_name: DIGIKEY; Distributor_part_number: 541-0.0JCT-ND; Library Ref: RESISTOR; Height: 0.40MM; Weight: 0.65mg; Temperature: -55°C+155°C; Datasheet: Y:\MIS_DATABASE\DATASHEETS\RESISTORS\CRCW0603.PDF; Crtd /date: MUDDU/190810; Chkd/date: VASANTHA/201216; MECHANICAL 3D STEP FILE: RES0402_0-5; Library Path: Y:\MIS_DATABASE\Library\ALTIUM_TOOL\SCHEMATICS_PARTS\MS_DISCRETE_Library.schlib; Footprint Path: Y:\MIS_DATABASE\Library\ALTIUM_TOOL\PCB_FOOTPRINTS\Altium_Footprint_Lib.PcbLib
R617 = RESISTOR_Dup6: as R257 on sheet 31; PCB Footprint: RES0402_0-5; Footprint Path: Y:\MIS_DATABASE\Library\ALTIUM_TOOL\PCB_FOOTPRINTS\Altium_Footprint_Lib.PcbLib; Library Path: Y:\MIS_DATABASE\Library\ALTIUM_TOOL\SCHEMATICS_PARTS\MS_DISCRETE_Library.schlib; MECHANICAL 3D STEP FILE: RES0402_0-5; Temperature: -55°C+155°C; Weight: 0.8mg; Library Ref: RESISTOR; Chkd/date: VASANTHA/291216; Crtd /date: GEETHA/260406; Datasheet: Y:\MIS_DATABASE\DATASHEETS\RESISTORS\PAN-ERJSER_NOV17.PDF; Height: 0.40MM; Distributor_part_number: P220JCT-ND; Distributor_name: DIGIKEY; Package: 0402; Wattage: 1/10W; Tolerance: 5%; Footprint Ref: RES0402_0-5
U78 = TVS2200_WSON6: IC 22V FLAT-CLAMP SURGE PROTECTION DEVICE WSON6; Part_type: ICS\POWER; Mfr_name: TEXAS INSTRUMENTS; Mistral Part No: 142021100001-R; Custom_Duty: 15%; Customs_HS_Code: 85423100; Wattage: NA; Project: TI_AM62x SKEVM_BRD; Footprint Path: Y:\MIS_DATABASE\Library\ALTIUM_TOOL\PCB_FOOTPRINTS\Altium_Footprint_Lib.PcbLib; Library Path: Y:\MIS_DATABASE\Library\ALTIUM_TOOL\SCHEMATICS_PARTS\MS_MISCPOWER_Library.schlib; MECHANICAL 3D STEP FILE: SON6_25-59_85X85_0-8; Chkd/date: MANIRAJA/011021; Crtd /date: ALVY/011021; Datasheet: Y:\MIS_DATABASE\DATASHEETS\ICS\POWER\TVS2200.PDF; Temperature: -40°C+125°C; Weight: 12mg; Height: 0.80MM; Footprint Ref: SON6_25-59_85X85_0-8; Library Ref: TVS2200_WSON6; Distributor_part_number: 296-52187-1-ND; Distributor_name: DIGIKEY; Package: WSON6; Voltage: NA; Tolerance: NA; Mfr_part_number: TVS2200DRVR; PCB Footprint: SON6_25-59_85X85_0-8